# Altium project Qadrature FM demodulator.PrjPcb
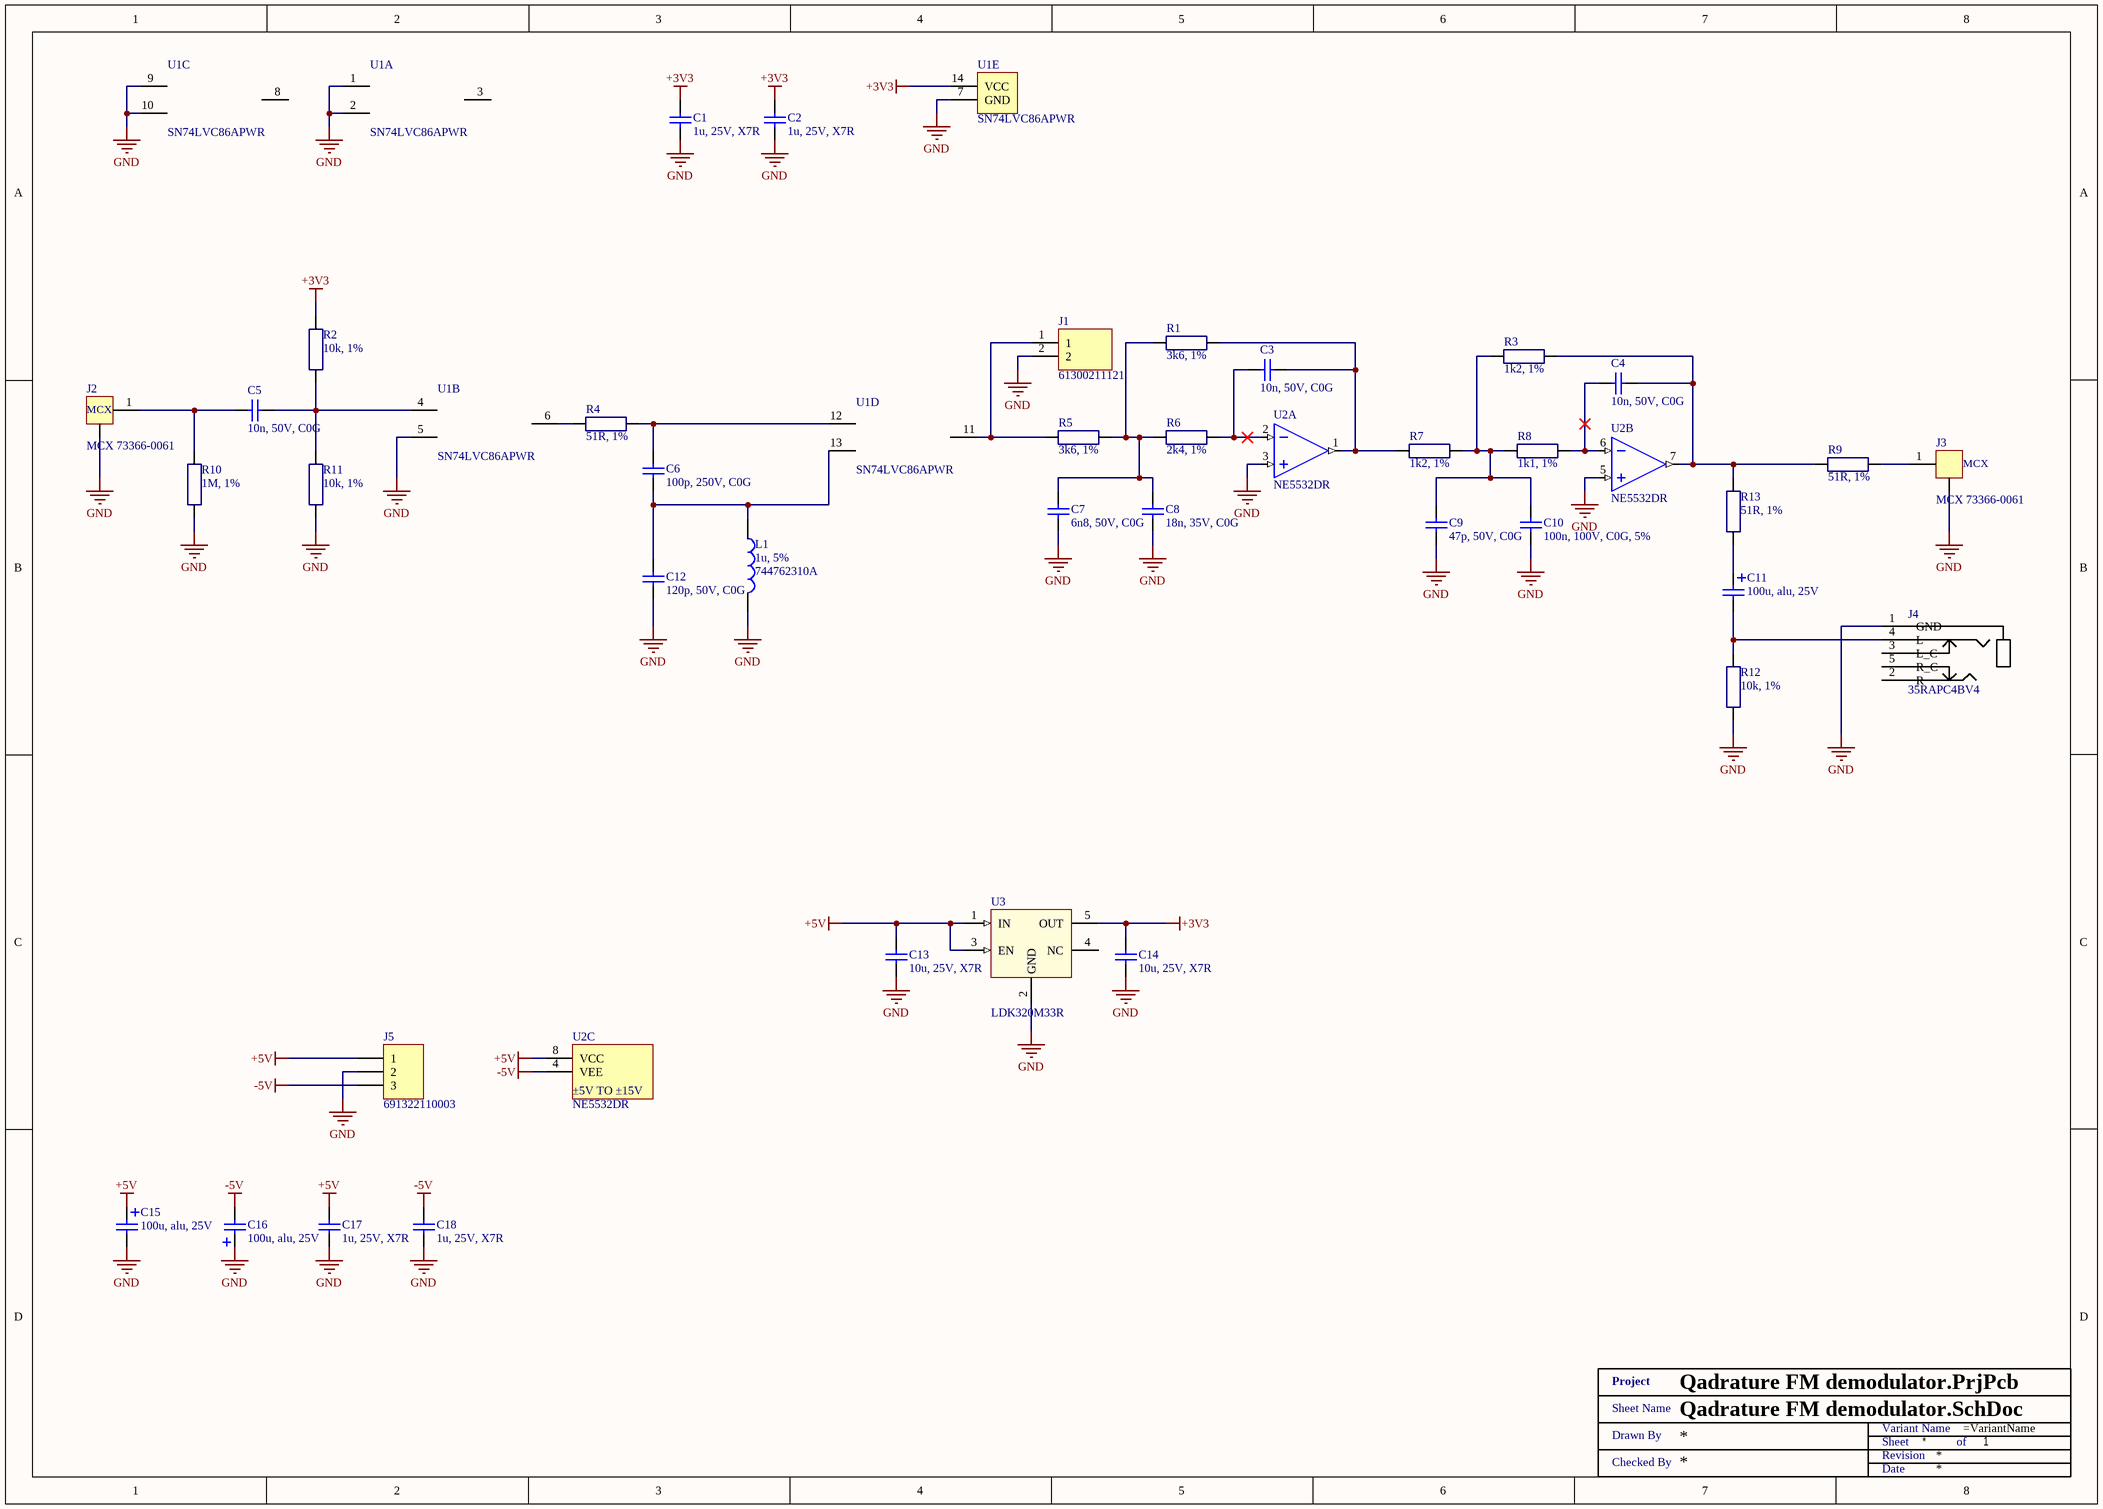
[diagram p0: Qadrature FM demodulator.SchDoc]
1 sheet, 41 parts. Net scope: global (net labels, ports and power ports of the same name join across sheets).
Board file: Qadrature FM demodulator.PcbDoc

## Sheet Qadrature FM demodulator.SchDoc
size A3; SheetNumber: 1; SheetTotal: 1

### Parts
C1  1u, 25V, X7R  [SMD0603]
C2  1u, 25V, X7R  [SMD0603]
C3  10n, 50V, C0G  [SMD0603]
C4  10n, 50V, C0G  [SMD0603]
C5  10n, 50V, C0G  [SMD0603]
C6  100p, 250V, C0G  [SMD0603]
C7  6n8, 50V, C0G  [SMD0603]
C8  18n, 35V, C0G  [SMD0603]
C9  47p, 50V, C0G  [SMD0805]
C10  100n, 100V, C0G, 5%  [SMD1206]
C11  100u, alu, 25V  [WCAP-ATLI_6.3x11x2.5]
C12  120p, 50V, C0G  [SMD0603]
C13  10u, 25V, X7R  [SMD1206]
C14  10u, 25V, X7R  [SMD1206]
C15  100u, alu, 25V  [WCAP-ATLI_6.3x11x2.5]
C16  100u, alu, 25V  [WCAP-ATLI_6.3x11x2.5]
C17  1u, 25V, X7R  [SMD0603]
C18  1u, 25V, X7R  [SMD0603]
J1  61300211121  [Header 2 2.54mm]
J2  MCX 73366-0061  [73366-0061]
J3  MCX 73366-0061  [73366-0061]
J4  35RAPC4BV4  [35RAPC4BV4]
J5  691322110003  [691322110003]
L1  1u, 5%  [WE-KI_1008]
R1  3k6, 1%  [SMD0603 - R]
R2  10k, 1%  [SMD0603 - R]
R3  1k2, 1%  [SMD0603 - R]
R4  51R, 1%  [SMD0603 - R]
R5  3k6, 1%  [SMD0603 - R]
R6  2k4, 1%  [SMD0603 - R]
R7  1k2, 1%  [SMD0603 - R]
R8  1k1, 1%  [SMD0603 - R]
R9  51R, 1%  [SMD0603 - R]
R10  1M, 1%  [SMD0603 - R]
R11  10k, 1%  [SMD0603 - R]
R12  10k, 1%  [SMD0603 - R]
R13  51R, 1%  [SMD0603 - R]
U1  SN74LVC86APWR  [TSSOP14]  (parts A,B,C,D,E of 5)
U2  NE5532DR  [SOIC08]  (parts A,B,C of 3)
U3  LDK320M33R  [SOT23-5]
XX?  Title 1  (value not drawn)  (graphical)

### Nets
+3V3: C1.2 C2.2 C14.2 R2.2 U1.14(VCC) U3.5(OUT)
+5V: C13.2 C15.1 C17.2 J5.1 U2.8(VCC) U3.1(IN) U3.3(EN)
-5V: C16.2 C18.2 J5.3 U2.4(VEE)
GND: C1.1 C2.1 C7.1 C8.1 C9.1 C10.1 C12.1 C13.1 C14.1 C15.2 C16.1 C17.1 C18.1 J1.2 J2.2(GND) J3.2(GND) J4.1(GND) J5.2 L1.2 R10.1 R11.1 R12.1 U1.1(1A) U1.2(1B) U1.5(2B) U1.7(GND) U1.9(3A) U1.10(3B) U2.3(+IN_A) U2.5(+IN_B) U3.2(GND)
NetC3_1: C3.1 R6.2 U2.2(-IN_A)
NetC3_2: C3.2 R1.2 R7.1 U2.1(OUT_A)
NetC4_1: C4.1 R8.2 U2.6(-IN_B)
NetC4_2: C4.2 R3.2 R9.1 R13.2 U2.7(OUT_B)
NetC5_1: C5.1 J2.1(INPUT) R10.2
NetC5_2: C5.2 R2.1 R11.2 U1.4(2A)
NetC6_1: C6.1 C12.2 L1.1 U1.13(4B)
NetC6_2: C6.2 R4.2 U1.12(4A)
NetC7_2: C7.2 C8.2 R1.1 R5.2 R6.1
NetC9_2: C9.2 C10.2 R3.1 R7.2 R8.1
NetC11_1: C11.1 R13.1
NetC11_2: C11.2 J4.4(L) R12.2
NetJ1_1: J1.1 R5.1 U1.11(4Y)
NetJ3_1: J3.1(INPUT) R9.2
NetR4_1: R4.1 U1.6(2Y)

Not connected (* = marked no-connect by the designer): J4 2(R) 3(L_C) 5(R_C); U1 3(1Y) 8(3Y); U3 4(NC)

### Notes on the sheet
- (in symbol NE5532DR, part C) ±5V TO ±15V
- (in symbol Title 1) Project; Sheet Name; Variant Name; Drawn By; Sheet; of; Revision; Checked By; Date

### Library data of the parts
C1 C2 C17 C18 = CGA3E1X7R1E105K080AC: CAP CER 1UF 25V X7R 0603; Manufacturer: TDK Corporation; Tolerance: ±10%; Manufacturer Part Number: CGA3E1X7R1E105K080AC; RoHS: RoHS Compliant; Category: Capacitors; Stock 1: 109509; Pricing 1: 1=0.2, 10=0.135, 100=0.0686, 500=0.04696, 1000=0.04154 (USD); Packaging: Cut Tape (CT); Part Status: Active; Voltage - Rated: 25V; Temperature Coefficient: X7R; Operating Temperature: -55°C ~ 125°C; Features: -; Ratings: AEC-Q200; Applications: Automotive; Failure Rate: -; Mounting Type: Surface Mount, MLCC; Package / Case: 0603 (1608 Metric); Size / Dimension: 0.063" L x 0.032" W (1.60mm x 0.80mm); Height - Seated (Max): -; Thickness (Max): 0.035" (0.90mm); Lead Spacing: -; Lead Style: -; ComponentLink1URL: https://product.tdk.com/info/en/catalog/datasheets/mlcc_automotive_general_en.pdf; ComponentLink1Description: https://product.tdk.com/info/en/catalog/datasheets/mlcc_automotive_general_en.pdf; Capacitance: 1u; Supplier 1: Mouser; Supplier Part Number 1: 810-CGA3E1X7R1E105K; Supplier 2: Farnell; Supplier Part Number 2: 2346962; Supplier 3: Digi-Key; Supplier Part Number 3: 445-6931-1-ND
C3-C5 = GRM1885C1H103JA01D: Multilayer Ceramic Capacitors MLCC - SMD/SMT 0603 50VDC 10000pF 5% C0G; Manufacturer: Murata Electronics; Type: Chip Multilayer Ceramic Capacitor for General Purpose; Capacitance - nF: 10 nF; Class: Class 1; CNHTS: 8532241000; Dielectric: C0G (NP0); TARIC: 8532240000; Supplier 1: Mouser; Supplier Part Number 1: 81-GRM1885C1H103JA1D; Manufacturer Part Number: GRM1885C1H103JA01D; RoHS: RoHS Compliant; Category: Multilayer Ceramic Capacitors MLCC - SMD/SMT; Stock 1: 217291; Pricing 1: 1=0.183, 10=0.129, 100=0.065, 500=0.045, 1000=0.039, 4000=0.030, 8000=0.027, 24000=0.025 (EUR); Capacitance: 10n; Height: 0.8 mm; Length: 1.6 mm; Package / Case: 0603 (1608 metric); Packaging: Cut Tape; Product: General Type MLCCs; Series: GRM; Termination Style: SMD/SMT; Tolerance: 5 %; Voltage Rating DC: 50 VDC; Width: 0.8 mm; Brand: Murata Electronics; Capacitance - pF: 10000 pF; Case Code - in: 0603; Case Code - mm: 1608; HTS Code: 8532240020; Maximum Operating Temperature: + 125 C; Minimum Operating Temperature: - 55 C; Product Type: Ceramic Capacitors; Standard Pack Qty: 4000; Subcategory: Capacitors; Termination: Standard; RoHS - Mouser: Y; Minimum Order Quantity: 1; Reeling: True; ComponentLink1URL: http://www.mouser.com/datasheet/2/281/murata_03052018_GRM_Series_1-1310166.pdf; ComponentLink1Description: http://www.mouser.com/datasheet/2/281/murata_03052018_GRM_Series_1-1310166.pdf; Supplier 2: Farnell; Supplier Part Number 2: 2456107
C6 = 885342006003: CAP CER 100PF 250V C0G/NP0 0603; Manufacturer: Wurth Electronics Inc.; Tolerance: ±5%; Temperature Coefficient: C0G, NP0; Notification: Current market demand for these product types have resulted in fluctuating and extending lead times. Lead times may differ.; Supplier 1: Digi-Key; Supplier Part Number 1: 732-12167-1-ND; Manufacturer Part Number: 885342006003; RoHS: RoHS Compliant; Category: Capacitors; Stock 1: 43; Pricing 1: 1=0.1, 10=0.043, 100=0.0385, 500=0.03406 (USD); Packaging: Cut Tape (CT); Part Status: Active; Voltage - Rated: 250V; Operating Temperature: -55°C ~ 125°C; Features: -; Ratings: -; Applications: General Purpose; Failure Rate: -; Mounting Type: Surface Mount, MLCC; Package / Case: 0603 (1608 Metric); Size / Dimension: 0.063" L x 0.031" W (1.60mm x 0.80mm); Height - Seated (Max): -; Thickness (Max): 0.034" (0.87mm); Lead Spacing: -; Lead Style: -; ComponentLink1URL: https://katalog.we-online.de/pbs/datasheet/885342006003.pdf; ComponentLink1Description: https://katalog.we-online.de/pbs/datasheet/885342006003.pdf; Supplier 2: Farnell; Supplier Part Number 2: 2812519; Supplier 3: Mouser; Supplier Part Number 3: 710-885342006003; Capacitance: 100p
C7 = GRM1885C1H682JA01D: Multilayer Ceramic Capacitors MLCC - SMD/SMT 0603 6,800pF 50volts C0G +/-5%; Manufacturer: Murata; Tolerance: 5%; Supplier 1: Mouser; Supplier Part Number 1: 81-GRM1885C1H682JA1D; Manufacturer Part Number: GRM1885C1H682JA01D; Stock 1: 117152; Pricing 1: 1 = 0.20000, 10 = 0.13500, 50 = 0.13500, 100 = 0.06800, 1000 = 0.04100, 10000 = 0.02900 (USD); RoHS: Yes; Mount: Surface Mount; Case/Package: 0603; Case Code (Metric): 1608; Case Code (Imperial): 0603; Min Operating Temperature: -55°C; Max Operating Temperature: 125°C; Packaging: Tape and Reel; Capacitance: 6n8; Voltage Rating: 50V; Voltage Rating (DC): 50V; Package Quantity: 4000; Dielectric: C0G; Termination: SMD/SMT; Length: 1.6mm; Height: 0.8mm; Width: 0.031inch; Thickness: 0.035inch; Depth: 0.8mm; Lead Free: Lead Free; ComponentLink1URL: https://datasheet.ciiva.com/29537/partnumbering-e-01-29537912.pdf?src-supplier=Digi-Key; ComponentLink1Description: https://datasheet.ciiva.com/29537/partnumbering-e-01-29537912.pdf?src-supplier=Digi-Key; Supplier 2: Digi-Key; Supplier Part Number 2: 490-11477-1-ND; Supplier 3: Arrow; Supplier Part Number 3: GRM1885C1H682JA01D
C8 = C1608C0G1V183J080AC: Cap Ceramic 0.018uF 35V C0G 5% Pad SMD 0603 125C T/R; Manufacturer: TDK; Supplier 1: Mouser; Supplier Part Number 1: 810-C1608C0G1V183JAC; Manufacturer Part Number: C1608C0G1V183J080AC; RoHS: Yes; Category: Ceramic Capacitors; Stock 1: 3185; Pricing 1: 1=0.37000, 10=0.16800, 50=0.16800, 100=0.14300, 1000=0.08800, 10000=0.06600 (USD); Mount: Surface Mount; Case/Package: 0603; Case Code (Metric): 1608; Case Code (Imperial): 0603; Dielectric Material: Ceramic; Min Operating Temperature: -55°C; Max Operating Temperature: 125°C; Packaging: Tape and Reel; Capacitance: 18n; Voltage Rating: 35V; Tolerance: 5%; Voltage Rating (DC): 35V; Length: 0.063inch; Width: 0.031inch; Thickness: 0.035inch; Lead Free: Lead Free; RoHS Compliant: Yes; ComponentLink1URL: https://product.tdk.com/info/en/catalog/spec/mlccspec_commercial_general_midvoltage_en.pdf?src-supplier=Digi-Key; ComponentLink1Description: https://product.tdk.com/info/en/catalog/spec/mlccspec_commercial_general_midvoltage_en.pdf?src-supplier=Digi-Key; Supplier 2: Farnell; Supplier Part Number 2: 3416084; Supplier 3: Digi-Key; Supplier Part Number 3: 445-174558-1-ND; Supplier 4: Newark; Supplier Part Number 4: 71AH3230
C9 = MC0805N470J500CT: MULTICOMP - MC0805N470J500CT - CAP, MLCC, C0G/NP0, 47PF, 50V, 0805; Ceramic Capacitor Case: 0805 [2012 Metric]; Capacitance: 47; Voltage Rating: 50; Capacitance Tolerance: ± 5%; Product Range: MC Series; SVHC: No SVHC (07-Jul-2017)<!--FANDB--><div class="features-and-benefits-container"><div class="features-and-benefits-desc-container"><span class="features-and-benefits-container-desc">SMD Multilayer Ceramic Capacitor, 0805 [2012 Metric], 47 pF, 50 V, ± 5%, C0G / NP0, MC Series</span></div><div class="features-and-benefits-description"><span class="features-benefits-value">The Multicomp MC series is general purpose MLCC capacitors with C0G (NP0) dielectric material which provides high electrical precision, stability and reliability. This MLCC capacitor consists of a conducting material and electrodes with high density and high efficiency ceramic condensers.</span></div><div class="features-and-benefits-list"><ul class="features-and-benefits-list-list"><li class="features-and-benefits-list-item">Small size with higher capacitance values</li><li class="features-and-benefits-list-item">0201, 0402, 0603, 0805, 1206, 1210, 1812 case sizes available</li><li class="features-and-benefits-list-item">Capacitance value ranging from 0.1pF to 0.1?F</li><li class="features-and-benefits-list-item">Capacitor with lead free termination (pure Tin)</li><li class="features-and-benefits-list-item">High electrical precision, stability and reliability</li><li class="features-and-benefits-list-item">Rated voltage of 10V, 16V, 25V, 50V, 100V</li><li class="features-and-benefits-list-item">Operating temperature of -55°C to +125°C</li><li class="features-and-benefits-list-item">Temperature coefficient (TCR) of ±30; Supplier 1: Farnell; Supplier Part Number 1: 1759199; Manufacturer: MULTICOMP; Manufacturer Part Number: MC0805N470J500CT; RoHS: YES; Stock 1: 26554; Pricing 1: 10=0.0144, 100=0.0117, 500=0.0083, 1000=0.0072, 2000=0.0057 (GBP); Dielectric Characteristic: C0G / NP0; Packaging: Cut Tape; Operating Temperature Min: -55; Operating Temperature Max: 125; Automotive Qualification Standard: -; MSL: -; ComponentLink1URL: http://www.farnell.com/datasheets/1901289.pdf; ComponentLink1Description: http://www.farnell.com/datasheets/1901289.pdf
C10 = GRM31C5C2A104JA01L: CAP CER 0.1UF 100V C0G/NP0 1206; Manufacturer: Murata Electronics North America; Temperature Coefficient: C0G, NP0; Notification: Current market demand for these product types have resulted in fluctuating and extending lead times. Lead times may differ.; Manufacturer Part Number: GRM31C5C2A104JA01L; RoHS: RoHS Compliant; Category: Capacitors; Stock 1: 1640; Pricing 1: 1=0.82, 10=0.581, 100=0.3823, 500=0.2832, 1000=0.24072 (USD); Packaging: Cut Tape (CT); Part Status: Active; Tolerance: ±5%; Voltage - Rated: 100V; Operating Temperature: -55°C ~ 125°C; Features: -; Ratings: -; Applications: General Purpose; Failure Rate: -; Mounting Type: Surface Mount, MLCC; Package / Case: 1206 (3216 Metric); Size / Dimension: 0.126" L x 0.063" W (3.20mm x 1.60mm); Height - Seated (Max): -; Thickness (Max): 0.071" (1.80mm); Lead Spacing: -; Lead Style: -; ComponentLink1URL: http://search.murata.co.jp/Ceramy/image/img/A01X/G101/ENG/GRM31C5C2A104JA01-01.pdf; ComponentLink1Description: http://search.murata.co.jp/Ceramy/image/img/A01X/G101/ENG/GRM31C5C2A104JA01-01.pdf; Capacitance: 100n; Dielectric: C0G; Supplier 1: Mouser; Supplier Part Number 1: 81-GRM31C5C2A104JA1L; Supplier 2: Digi-Key; Supplier Part Number 2: 490-16315-1-ND
C11 C15 C16 = 860010473007: CAP 100 UF 20% 25 V; Manufacturer: Wurth Electronics; Material: Aluminium; Capacitance: 100uF; Polarity: Polar; Ripple Current: 209mA; Life (Hours): 2000Hour; Supplier 1: Mouser; Supplier Part Number 1: 710-860010473007; Manufacturer Part Number: 860010473007; RoHS: Yes; Category: Aluminum Electrolytic Capacitors; Stock 1: 1494; Pricing 1: 1=0.14000, 10=0.13400, 25=0.13400, 50=0.11200, 100=0.09800, 250=0.08700 (USD); Mount: Through Hole; Case/Package: Radial; Min Operating Temperature: -40°C; Max Operating Temperature: 85°C; Tolerance: 20%; Voltage Rating (DC): 25V; Package Quantity: 1500; Packaging: Tape and Reel; Voltage Rating: 25V; Diameter: 6.3mm; Height: 11mm; Lead Pitch: 0.098inch; Height - Seated (Max): 0.492inch; REACH SVHC: Unknown; ComponentLink1URL: https://datasheet.ciiva.com/48693/001280151-da-01-en-wcap-atg8-alu-elec-caps-860010473007-48693591.pdf?src-supplier=Conrad; ComponentLink1Description: https://datasheet.ciiva.com/48693/001280151-da-01-en-wcap-atg8-alu-elec-caps-860010473007-48693591.pdf?src-supplier=Conrad; Supplier 2: Farnell; Supplier Part Number 2: 2465675; Supplier 3: Digi-Key; Supplier Part Number 3: 732-8630-1-ND
C12 = CC0603JRNPO9BN121: Surface Mount Ceramic Multilayer Capacitor 120pF 5% C0G 50V 0603 Paper T/R; Manufacturer: Yageo; Insulation Resistance: 100GR; Supplier 1: Mouser; Supplier Part Number 1: 603-CC603JRNPO9BN121; Manufacturer Part Number: CC0603JRNPO9BN121; RoHS: Yes; Category: Ceramic Capacitors; Stock 1: 20714; Pricing 1: 1=0.10000, 10=0.06400, 50=0.06400, 100=0.02900, 1000=0.01700, 10000=0.01100 (USD); Mount: Surface Mount; Case/Package: 0603; Case Code (Metric): 1608; Case Code (Imperial): 0603; Dielectric Material: Ceramic; Min Operating Temperature: -55°C; Max Operating Temperature: 125°C; Capacitance: 120pF; Tolerance: 5%; Packaging: Tape and Reel; Voltage Rating: 50V; Voltage Rating (DC): 50V; Package Quantity: 1; Dielectric: C0G; Termination: SMD/SMT; Resistor Type: Ceramic; Series: CC; Length: 1.6mm; Width: 0.031inch; Height: 0.8mm; Thickness: 0.035inch; Depth: 0.8mm; Radiation Hardening: No; REACH SVHC: Unknown; Lead Free: Lead Free; RoHS Compliant: Yes; ComponentLink1URL: https://datasheet.ciiva.com/26862/getdatasheetpartid-137962-26862760.pdf?src-supplier=Verical; ComponentLink1Description: https://datasheet.ciiva.com/26862/getdatasheetpartid-137962-26862760.pdf?src-supplier=Verical; ComponentLink2URL: https://datasheet.ciiva.com/144/mlccorderingcode-144699.pdf?src-supplier=Digi-Key; ComponentLink2Description: https://datasheet.ciiva.com/144/mlccorderingcode-144699.pdf?src-supplier=Digi-Key; ComponentLink3URL: https://datasheet.ciiva.com/8033/1443161-8033719.pdf?src-supplier=Element14; ComponentLink3Description: https://datasheet.ciiva.com/8033/1443161-8033719.pdf?src-supplier=Element14; ComponentLink4URL: https://datasheet.ciiva.com/17437/upy-gp-np0-16v-to-50v-8-17437015.pdf?src-supplier=Avnet+Europe; ComponentLink4Description: https://datasheet.ciiva.com/17437/upy-gp-np0-16v-to-50v-8-17437015.pdf?src-supplier=Avnet+Europe; ComponentLink5URL: https://datasheet.ciiva.com/8033/1443161-8033720.pdf?src-supplier=Element14; ComponentLink5Description: https://datasheet.ciiva.com/8033/1443161-8033720.pdf?src-supplier=Element14; ComponentLink6URL: https://datasheet.ciiva.com/144/mlccorderingcode-144697.pdf?src-supplier=Digi-Key; ComponentLink6Description: https://datasheet.ciiva.com/144/mlccorderingcode-144697.pdf?src-supplier=Digi-Key; ComponentLink7URL: https://datasheet.ciiva.com/11465/upy-gp-np0-16v-to-50v-8-11465007.pdf?src-supplier=Avnet; ComponentLink7Description: https://datasheet.ciiva.com/11465/upy-gp-np0-16v-to-50v-8-11465007.pdf?src-supplier=Avnet; ComponentLink8URL: https://datasheet.ciiva.com/144/mlccorderingcode-144698.pdf?src-supplier=Digi-Key; ComponentLink8Description: https://datasheet.ciiva.com/144/mlccorderingcode-144698.pdf?src-supplier=Digi-Key; ComponentLink9URL: https://datasheet.ciiva.com/15381/upy-gp-np0-16v-to-50v-8-15381898.pdf?src-supplier=Mouser; ComponentLink9Description: https://datasheet.ciiva.com/15381/upy-gp-np0-16v-to-50v-8-15381898.pdf?src-supplier=Mouser; Supplier 2: Farnell; Supplier Part Number 2: 722091; Supplier 3: Digi-Key; Supplier Part Number 3: 311-1070-1-ND
C13 C14 = GRM31CR71E106KA12L: MURATA - GRM31CR71E106KA12L - CAP, MLCC, X7R, 10UF, 25V, 1206; Manufacturer: MURATA; Manufacturer Part Number: GRM31CR71E106KA12L; RoHS: YES; Stock 1: 8848; Pricing 1: 5=0.278, 50=0.185, 250=0.139, 500=0.134, 1000=0.128 (GBP); ComponentLink1URL: http://www.farnell.com/datasheets/2048746.pdf; ComponentLink1Description: http://www.farnell.com/datasheets/2048746.pdf; Capacitance: 10u; Dielectric: X7R; Supplier 1: Mouser; Supplier Part Number 1: 81-GRM31CR71E106KA12; Supplier 2: Farnell; Supplier Part Number 2: 1828837; Supplier 3: Digi-Key; Supplier Part Number 3: 490-6518-1-ND
J1 = 61300211121: CONN HEADER 2 POS 2.54; Manufacturer: Wurth Electronics Inc.; Pitch - Mating: 0.100" (2.54mm); Number of Positions: 2; Number of Positions Loaded: All; Style: Board to Board or Cable; Shrouding: Unshrouded; Contact Length - Mating: 0.236" (6.00mm); Contact Length - Post: 0.118" (3.00mm); Overall Contact Length: 0.454" (11.54mm); Material Flammability Rating: UL94 V-0; Current Rating: 3A; Voltage Rating: 250V; Manufacturer Part Number: 61300211121; RoHS: RoHS Compliant; Category: Connectors, Interconnects; Stock 1: 164911; Pricing 1: 1=0.13, 10=0.106, 25=0.088, 50=0.074, 100=0.067, 1000=0.061 (USD); Packaging: Bulk; Part Status: Active; Connector Type: Header; Contact Type: Male Pin; Number of Rows: 1; Row Spacing - Mating: -; Mounting Type: Through Hole; Termination: Solder; Fastening Type: Push-Pull; Insulation Height: 0.100" (2.54mm); Contact Shape: Square; Contact Finish - Mating: Gold; Contact Finish Thickness - Mating: -; Contact Finish - Post: -; Contact Material: Copper Alloy; Insulation Material: Polybutylene Terephthalate (PBT); Features: -; Operating Temperature: -40°C ~ 125°C; Ingress Protection: -; Insulation Color: Black; Mated Stacking Heights: -; Contact Finish Thickness - Post: -; Applications: -; ComponentLink1URL: https://katalog.we-online.de/em/datasheet/6130xx11121.pdf; ComponentLink1Description: https://katalog.we-online.de/em/datasheet/6130xx11121.pdf; Supplier 1: Mouser; Supplier Part Number 1: 710-61300211121; Supplier 2: Farnell; Supplier Part Number 2: 2356153; Supplier 3: Digi-Key; Supplier Part Number 3: 732-5315-ND
J2 J3 = 73366-0061: CONN MCX JACK STR 50 OHM PCB; Manufacturer: Molex, LLC; Manufacturer Part Number: 0733660061; Connector Type: Jack, Female Socket; Contact Termination: Solder; Impedance: 50 Ohm; Body Material: Brass; Body Finish: Gold; Dielectric Material: Polytetrafluoroethylene (PTFE); Center Contact Material: Beryllium Copper; Mating Cycles: 500; RoHS: RoHS Compliant; Category: Connectors, Interconnects; Stock 1: 39394; Pricing 1: 1=1.95, 10=1.765, 25=1.6572, 50=1.5854, 100=1.5133, 250=1.36916, 500=1.26106, 1000=1.0809, 2500=1.00884 (USD); Packaging: Tray; Part Status: Active; Connector Style: MCX; Shield Termination: Solder; Mounting Type: Through Hole; Mounting Feature: -; Cable Group: -; Fastening Type: Snap-On; Features: -; Housing Color: Gold; Ingress Protection: -; Includes: -; Center Contact Plating: Gold; Operating Temperature: -55°C ~ 155°C; Insertion Loss: -; ComponentLink1URL: https://www.molex.com/pdm_docs/sd/733660061_sd.pdf; ComponentLink1Description: https://www.molex.com/pdm_docs/sd/733660061_sd.pdf; Supplier 1: Mouser; Supplier Part Number 1: 538-73366-0061; Supplier 2: Digi-Key; Supplier Part Number 2: WM5541-ND; Supplier 3: Farnell; Supplier Part Number 3: 1909245
J4 = 35RAPC4BV4: SWITCHCRAFT - 35RAPC4BV4 - CONNECTOR, RCA/PHONO, JACK, 3WAY; No. of Contacts: 3; Pin Diameter: 3.5; Connector Mounting: PCB Mount; Connector Body Material: Plastic Body; SVHC: No SVHC (15-Jun-2015); Connector Colour: Black; Contact Termination: Solder<!--FANDB--><div class="features-and-benefits-container"><div class="features-and-benefits-description"><span class="features-benefits-value">The 35RAPC4BV4 is a 3.5mm Mono and Stereo PC Board Vertical-mount Jack with black PBT+15% glass filled housing, nickel-plated brass bushing, tin-plated phosphor bronze springs and a clear polycarbonate cover. The compact design and an easy of installation onto a PCB make this an ideal solution.</span></div><div class="features-and-benefits-list"><ul class="features-and-benefits-list-list"><li class="features-and-benefits-list-item">5000 cycles Life</li><li class="features-and-benefits-list-item">50; Supplier 1: Farnell; Supplier Part Number 1: 2293877; Manufacturer: SWITCHCRAFT; Manufacturer Part Number: 35RAPC4BV4; RoHS: YES; Stock 1: 216; Pricing 1: 1=1.28, 25=1.11, 50=1.06, 100=1.01, 250=0.975, 500=0.939 (GBP); Gender: Jack; Contact Plating: Tin Plated Contacts; Product Range: -; ComponentLink1URL: http://www.farnell.com/datasheets/921436.pdf; ComponentLink1Description: http://www.farnell.com/datasheets/921436.pdf; Supplier 2: Digi-Key; Supplier Part Number 2: SC1461-ND
J5 = 691322110003: WR-TBL Serie 3221 - 3.50 mm Horizontal PCB Header, 03p; Pitch: 3.5 mm; Published Date: Jan 2017; Publisher: Wurth Elektronik; ComponentLink1Description: Manufacturer; ComponentLink1URL: http://www.we-online.de; ComponentLink2Description: Datasheet; ComponentLink2URL: http://katalog.we-online.de/em/datasheet/6913221100xx.pdf; Part Number: 691322110003; Pin Number: 03p; Supplier 1: Digi-Key; Supplier Part Number 1: 732-2770-ND; Supplier 2: Farnell; Supplier Part Number 2: 1841316
L1 = 744762310A: Fixed Ind 1UH 120MA 3.3 Ohm SMD; Manufacturer: Wurth Electronics; Core Material: Ceramic; Shielding: Unshielded; Self Resonant Frequency: 310MHz; DC Resistance (DCR): 3.3R; Test Frequency: 25MHz; Q Factor: 35; Supplier 1: Mouser; Supplier Part Number 1: 710-744762310A; RoHS: Yes; Category: Fixed Inductors; Stock 1: 1904; Pricing 1: 1=0.41000, 10=0.38200, 50=0.35700, 100=0.33000, 1000=0.30300, 10000=0.25600 (USD); Mount: Surface Mount; Case/Package: 1008; Case Code (Metric): 2520; Case Code (Imperial): 1008; Min Operating Temperature: -40°C; Max Operating Temperature: 125°C; Package Quantity: 2000; Current Rating: 120mA; Tolerance: 5%; Packaging: Tape and Reel; Resistor Type: Wirewound,Ceramic; Inductance: 1uH; Max DC Current: 120mA; Termination: SMD/SMT; Series: WE-KI; Length: 0.102inch; Width: 0.083inch; Height: 0.039inch; Height - Seated (Max): 0.075inch; RoHS Compliant: Yes; ComponentLink1URL: https://datasheet.ciiva.com/1049/744762310a-1049271.pdf?src-supplier=Digi-Key; ComponentLink1Description: https://datasheet.ciiva.com/1049/744762310a-1049271.pdf?src-supplier=Digi-Key; ComponentLink2URL: https://datasheet.ciiva.com/4978/744762310a-69476-4978731.pdf?src-supplier=Mouser; ComponentLink2Description: https://datasheet.ciiva.com/4978/744762310a-69476-4978731.pdf?src-supplier=Mouser; ComponentLink3URL: https://datasheet.ciiva.com/1049/744762310a-1049272.pdf?src-supplier=Digi-Key; ComponentLink3Description: https://datasheet.ciiva.com/1049/744762310a-1049272.pdf?src-supplier=Digi-Key; ComponentLink4URL: https://datasheet.ciiva.com/1049/744762310a-1049273.pdf?src-supplier=Digi-Key; ComponentLink4Description: https://datasheet.ciiva.com/1049/744762310a-1049273.pdf?src-supplier=Digi-Key; Supplier 2: Farnell; Supplier Part Number 2: 3517053; Supplier 3: Digi-Key; Supplier Part Number 3: 732-1832-1-ND; Manufacturer Part Number: 744762310A
R1 R5 = RC0603FR-073K6L: RES SMD 3.6K OHM 1% 1/10W 0603; Manufacturer: Yageo; Power Rating: 100mW; Voltage Rating: 50V; Temperature Coefficient: 100ppm/°C; Working Voltage: 75V; Supplier 1: Mouser; Supplier Part Number 1: 603-RC0603FR-073K6L; Manufacturer Part Number: RC0603FR-073K6L; RoHS: Yes; Category: Chip SMD Resistors; Stock 1: 130231; Pricing 1: 1=0,10000, 10=0,01800, 50=0,01800, 100=0,00600, 1000=0,00500, 10000=0,00300 (USD); Case/Package: 0603; Number of Pins: 2; Case Code (Imperial): 0603; Case Code (Metric): 1608; Min Operating Temperature: -55°C; Max Operating Temperature: 155°C; Resistance: 3k6; Tolerance: 1%; Package Quantity: 1; Packaging: Tape and Reel; Termination: SMD/SMT; Resistor Type: Thick Film; Number of Terminations: 2; Max Power Dissipation: 100mW; Voltage Rating (DC): 50V; Features: Moisture Resistant; Series: RC; Technology: METAL OXIDE FILM; Resistance Tolerance: 1%; Length: 0.063inch; Width: 0.8mm; Height: 0.022inch; REACH SVHC: Unknown; Lead Free: Lead Free; RoHS Compliant: Yes; ComponentLink1URL: https://datasheet.ciiva.com/2455/pyu-r-int-thick-7-2455116.pdf?src-supplier=Digi-Key; ComponentLink1Description: https://datasheet.ciiva.com/2455/pyu-r-int-thick-7-2455116.pdf?src-supplier=Digi-Key; ComponentLink2URL: https://datasheet.ciiva.com/2455/pyu-r-int-thick-7-2455117.pdf?src-supplier=Digi-Key; ComponentLink2Description: https://datasheet.ciiva.com/2455/pyu-r-int-thick-7-2455117.pdf?src-supplier=Digi-Key; ComponentLink3URL: https://datasheet.ciiva.com/2455/pyu-r-int-thick-7-2455118.pdf?src-supplier=Digi-Key; ComponentLink3Description: https://datasheet.ciiva.com/2455/pyu-r-int-thick-7-2455118.pdf?src-supplier=Digi-Key; Supplier 2: Farnell; Supplier Part Number 2: 3495832; Supplier 3: Digi-Key; Supplier Part Number 3: 311-3.60KHRCT-ND
R2 R11 R12 = RC0603FR-0710KL: YAGEO (PHYCOMP) - RC0603FR-0710KL - RES, THICK FILM, 10K, 1%, 0.1W, 0603; Voltage Rating: 50; Resistor Case Style: 0603 [1608 Metric]; Power Rating: 100; Product Range: RC Series; Temperature Coefficient: ± 100; SVHC: No SVHC (20-Jun-2016); Manufacturer: YAGEO (PHYCOMP); Manufacturer Part Number: RC0603FR-0710KL; RoHS: YES; Stock 1: 9995; Pricing 1: 5000=0.0025, 25000=0.0014, 50000=0.0013 (GBP); Resistance: 10k; Resistance Tolerance: ± 1%; Packaging: Tape & Reel; Resistor Element Material: Thick Film; Automotive Qualification Standard: -; MSL: MSL 1 - Unlimited<!--FANDB--><div class="features-and-benefits-container"><div class="features-and-benefits-desc-container"><span class="features-and-benefits-container-desc">SMD Chip Resistor, Thick Film, 10 kohm, 50 V, 0603 [1608 Metric], 100 mW, ± 1; ComponentLink1URL: http://past.yageo.com/pdf/PYu-R_Packing_6.pdf; ComponentLink1Description: http://past.yageo.com/pdf/PYu-R_Packing_6.pdf; ComponentLink2URL: http://www.farnell.com/datasheets/2167052.pdf; ComponentLink2Description: http://www.farnell.com/datasheets/2167052.pdf; Supplier 1: Mouser; Supplier Part Number 1: 603-RC0603FR-0710KL; Supplier 2: Farnell; Supplier Part Number 2: 2421850; Supplier 3: Digi-Key; Supplier Part Number 3: 311-10.0KHRCT-ND
R3 R7 = WR06X1201FTL: WALSIN - WR06X1201FTL - RESISTOR, THICK FILM, 1K2, 1%, 75V, 0603; Voltage Rating: 75; Resistor Case Style: 0603 [1608 Metric]; Power Rating: 100; Product Range: WR06 Series; Temperature Coefficient: ± 100; Manufacturer: WALSIN; Manufacturer Part Number: WR06X1201FTL; RoHS: YES; Stock 1: 8072; Pricing 1: 10=0.0134, 100=0.0045, 500=0.0027, 1000=0.0019, 2500=0.0015 (GBP); Resistance: 1k2; Resistance Tolerance: ± 1%; Packaging: Cut Tape; Resistor Element Material: Thick Film; Automotive Qualification Standard: -; MSL: MSL 2 - 1 year<!--FANDB--><div class="features-and-benefits-container"><div class="features-and-benefits-desc-container"><span class="features-and-benefits-container-desc">SMD Chip Resistor, 1.2 kohm, 75 V, 0603 [1608 Metric], 100 mW, ± 1%, WR06 Series</span></div><div class="features-and-benefits-description"><span class="features-benefits-value">The WR06 series resistors from Walsin are general purpose thick film chip resistors. These resistors are constructed in a high grade ceramic body (aluminium oxide).</span></div><div class="features-and-benefits-list"><ul class="features-and-benefits-list-list"><li class="features-and-benefits-list-item">Resistance range includes E24 and E96 decade values from 1ohm to 10Mohm</li><li class="features-and-benefits-list-item">EIA 0603 case size</li><li class="features-and-benefits-list-item">Available in ?±100ppm/°C and -200ppm/°C to +400ppm/°C TCR values</li><li class="features-and-benefits-list-item">Available in ±1% and ±5% tolerance</li><li class="features-and-benefits-list-item">High reliability and stability</li><li class="features-and-benefits-list-item">Higher component and equipment reliability</li><li class="features-and-benefits-list-item">Lower assembly costs</li><li class="features-and-benefits-list-item">Reduced size of final equipment</li><li class="features-and-benefits-list-item">Continuous working voltage is 75V and rated power is 100; ComponentLink1URL: http://www.farnell.com/datasheets/1960319.pdf; ComponentLink1Description: http://www.farnell.com/datasheets/1960319.pdf; Supplier 1: Farnell; Supplier Part Number 1: 2502404; Supplier 2: Newark; Supplier Part Number 2: 58Y7264
R4 R9 R13 = CRCW060351R0FKEA: RES SMD 51 OHM 1% 1/10W 0603; Manufacturer: Vishay Dale; Power (Watts): 0.1W, 1/10W; Temperature Coefficient: ±100ppm/°C; Manufacturer Part Number: CRCW060351R0FKEA; RoHS: RoHS Compliant; Category: Resistors; Stock 1: 21691; Pricing 1: 1=0.1, 10=0.042, 100=0.017, 1000=0.00764, 2500=0.00663 (USD); Packaging: Cut Tape (CT); Part Status: Active; Tolerance: ±1%; Composition: Thick Film; Features: Automotive AEC-Q200; Operating Temperature: -55°C ~ 155°C; Package / Case: 0603 (1608 Metric); Supplier Device Package: 0603; Size / Dimension: 0.063" L x 0.033" W (1.60mm x 0.85mm); Height - Seated (Max): 0.020" (0.50mm); Failure Rate: -; ComponentLink1URL: http://www.vishay.com/docs/20035/dcrcwe3.pdf; ComponentLink1Description: http://www.vishay.com/docs/20035/dcrcwe3.pdf; Resistance: 51R; Supplier 1: Mouser; Supplier Part Number 1: 71-CRCW0603-51-E3; Supplier 2: Farnell; Supplier Part Number 2: 1652889; Supplier 3: Digi-Key; Supplier Part Number 3: 541-51.0HCT-ND
R6 = RC0603FR-072K4L: RES SMD 2.4K OHM 1% 1/10W 0603; Manufacturer: Yageo; Power (Watts): 0.1W, 1/10W; Temperature Coefficient: ±100ppm/°C; Manufacturer Part Number: RC0603FR-072K4L; RoHS: RoHS Compliant; Category: Resistors; Stock 1: 577810; Pricing 1: 1=0.1, 10=0.015, 100=0.006, 1000=0.00268, 2500=0.00233 (USD); Packaging: Cut Tape (CT); Part Status: Active; Tolerance: ±1%; Composition: Thick Film; Features: Moisture Resistant; Operating Temperature: -55°C ~ 155°C; Package / Case: 0603 (1608 Metric); Supplier Device Package: 0603; Size / Dimension: 0.063" L x 0.032" W (1.60mm x 0.80mm); Height - Seated (Max): 0.022" (0.55mm); Failure Rate: -; ComponentLink1URL: http://www.yageo.com/documents/recent/PYu-RC_Group_51_RoHS_L_8.pdf; ComponentLink1Description: http://www.yageo.com/documents/recent/PYu-RC_Group_51_RoHS_L_8.pdf; Resistance: 2k4; Supplier 1: Mouser; Supplier Part Number 1: 603-RC0603FR-072K4L; Supplier 2: Farnell; Supplier Part Number 2: 1799329; Supplier 3: Digi-Key; Supplier Part Number 3: 311-2.40KHRCT-ND
R8 = MCWR06X1101FTL: MULTICOMP - MCWR06X1101FTL - RES, THICK FILM, 1K1, 1%, 0.1W, 0603; Voltage Rating: 50; Resistor Case Style: 0603 [1608 Metric]; Power Rating: 100; Product Range: MCWR Series; Temperature Coefficient: ± 100; SVHC: No SVHC (07-Jul-2017)<!--FANDB--><div class="features-and-benefits-container"><div class="features-and-benefits-desc-container"><span class="features-and-benefits-container-desc">SMD Chip Resistor, Thick Film, 1.1 kohm, 50 V, 0603 [1608 Metric], 100 mW, ± 1; Supplier 1: Farnell; Supplier Part Number 1: 2447274; Manufacturer: MULTICOMP; Manufacturer Part Number: MCWR06X1101FTL; RoHS: Y-EX; Stock 1: 8493; Pricing 1: 10=0.0035, 100=0.0021, 500=0.0015, 1000=0.0012, 2500=0.001 (GBP); Resistance: 1k1; Resistance Tolerance: ± 1%; Packaging: Cut Tape; Resistor Element Material: Thick Film; Automotive Qualification Standard: -; ComponentLink1URL: http://www.farnell.com/datasheets/1849611.pdf; ComponentLink1Description: http://www.farnell.com/datasheets/1849611.pdf
R10 = CRCW06031M00FKEB: RES SMD 1M OHM 1% 1/10W 0603; Manufacturer: Vishay Dale; Power (Watts): 0.1W, 1/10W; Temperature Coefficient: ±100ppm/°C; Manufacturer Part Number: CRCW06031M00FKEB; RoHS: RoHS Compliant; Category: Resistors; Stock 1: 0; Pricing 1: 20000=0.00432, 30000=0.00405 (USD); Packaging: Tape & Reel (TR); Part Status: Active; Tolerance: ±1%; Composition: Thick Film; Features: Automotive AEC-Q200; Operating Temperature: -55°C ~ 155°C; Package / Case: 0603 (1608 Metric); Supplier Device Package: 0603; Size / Dimension: 0.063" L x 0.033" W (1.60mm x 0.85mm); Height - Seated (Max): 0.020" (0.50mm); Failure Rate: -; ComponentLink1URL: http://www.vishay.com/docs/20035/dcrcwe3.pdf; ComponentLink1Description: http://www.vishay.com/docs/20035/dcrcwe3.pdf; Resistance: 1M; Supplier 1: Mouser; Supplier Part Number 1: 71-CRCW06031M00FKEB; Supplier 2: Farnell; Supplier Part Number 2: 1853280; Supplier 3: Digi-Key; Supplier Part Number 3: CRCW06031M00FKEB-ND
U1 = SN74LVC86APWR: 4-ch, 2-input, 1.65-V to 3.6-V XOR (exclusive OR) gates 14-TSSOP -40 to 125; Manufacturer: Texas Instruments; Number of Elements: 4; Propagation Delay: 4.4ns; Max Supply Voltage: 3.6V; Min Supply Voltage: 1.65V; Number of Outputs: 1; Number of Inputs: 2; Quiescent Current: 1uA; High Level Output Current: -24mA; Low Level Output Current: 24mA; Turn-On Delay Time: 4.6ns; Schmitt Trigger Input: No; Supplier 1: Mouser; Supplier Part Number 1: 595-SN74LVC86APWR; Manufacturer Part Number: SN74LVC86APWR; RoHS: Yes; Category: Logic Gates; Stock 1: 443; Pricing 1: 1=0.49000, 10=0.39400, 50=0.39400, 100=0.24300, 1000=0.15100, 10000=0.13800 (USD); Mount: Surface Mount; Case/Package: TSSOP; Number of Pins: 14; Weight: 0.002018oz; Contact Plating: Gold; Min Operating Temperature: -40°C; Max Operating Temperature: 125°C; Packaging: Tape and Reel; Logic Function: XOR; Package Quantity: 1; Number of Circuits: 4; Number of Gates: 4; Number of Input Lines: 2; Number of Output Lines: 1; Number of Bits: 4; Length: 5mm; Width: 4.4mm; Height: 1.15mm; Radiation Hardening: No; Lead Free: Lead Free; RoHS Compliant: Yes; REACH SVHC: No SVHC; ComponentLink1URL: https://datasheet.ciiva.com/14290/sn54lvc86a-14290721.pdf?src-supplier=Avnet; ComponentLink1Description: https://datasheet.ciiva.com/14290/sn54lvc86a-14290721.pdf?src-supplier=Avnet; ComponentLink2URL: https://datasheet.ciiva.com/41455/001017231-da-01-en-ic-qu-2in-exc-sn74lvc86apwr-tssop-14-tid-41455867.pdf?src-supplier=Conrad; ComponentLink2Description: https://datasheet.ciiva.com/41455/001017231-da-01-en-ic-qu-2in-exc-sn74lvc86apwr-tssop-14-tid-41455867.pdf?src-supplier=Conrad; ComponentLink3URL: https://datasheet.ciiva.com/46439/1847506-46439206.pdf?src-supplier=Element14; ComponentLink3Description: https://datasheet.ciiva.com/46439/1847506-46439206.pdf?src-supplier=Element14; ComponentLink4URL: https://datasheet.ciiva.com/1865/sn74lvc86a-1865017.pdf?src-supplier=Digi-Key; ComponentLink4Description: https://datasheet.ciiva.com/1865/sn74lvc86a-1865017.pdf?src-supplier=Digi-Key; ComponentLink5URL: https://datasheet.ciiva.com/1865/sn74lvc86a-1865016.pdf?src-supplier=Digi-Key; ComponentLink5Description: https://datasheet.ciiva.com/1865/sn74lvc86a-1865016.pdf?src-supplier=Digi-Key; ComponentLink6URL: https://datasheet.ciiva.com/1865/sn74lvc86a-1865018.pdf?src-supplier=Digi-Key; ComponentLink6Description: https://datasheet.ciiva.com/1865/sn74lvc86a-1865018.pdf?src-supplier=Digi-Key; ComponentLink7URL: https://datasheet.ciiva.com/15221/getdatasheetpartid-247160-15221930.pdf?src-supplier=Verical; ComponentLink7Description: https://datasheet.ciiva.com/15221/getdatasheetpartid-247160-15221930.pdf?src-supplier=Verical; Supplier 2: Farnell; Supplier Part Number 2: 3120672; Supplier 3: Digi-Key; Supplier Part Number 3: 296-1242-1-ND; Supplier 4: Arrow Electronics; Supplier Part Number 4: SN74LVC86APWR
U2 = NE5532DR: 2-channel, 10-MHz, 26-V output swing, low-noise audio op amp 8-SOIC 0 to 70; Manufacturer: Texas Instruments; Bandwidth: 10MHz; Number of Channels: 2; Voltage Gain: 100dB; Min Dual Supply Voltage: 5V; Max Dual Supply Voltage: 15V; Output Current: 38mA; Nominal Supply Current: 16mA; Common Mode Rejection Ratio: 70dB; Slew Rate: 9V/µs; Max I/O Voltage: 4mV; Input Bias Current: 800nA; Operating Supply Current: 8mA; Dual Supply Voltage: 9V; Parameter 1: Jellybean; Supplier 1: Mouser; Supplier Part Number 1: 595-NE5532DR; Manufacturer Part Number: NE5532DR; RoHS: Yes; Category: Amplifiers - Op Amps, Buffer, Instrumentation; Pricing 1: 1=0.60000, 10=0.51400, 50=0.51400, 100=0.35600, 500=0.30100, 1000=0.23300, 2500=0.21100, 10000=0.21100 (USD); Case/Package: D; Number of Pins: 8; Contact Plating: Gold; Min Operating Temperature: 0°C; Max Operating Temperature: 70°C; Packaging: Tape and Reel; Number of Circuits: 2; Gain Bandwidth Product: 10MHz; Unity Gain Bandwidth Product: 10MHz; Package Quantity: 1; Nominal Gain Bandwidth Product: 10MHz; Input Offset Voltage (Vos): 4mV; Output Current per Channel: 38mA; Number of Elements: 2; Max Supply Voltage: 15V; Number of Amplifiers: 2; Length: 4.9mm; Width: 3.91mm; Height: 1.58mm; Radiation Hardening: No; Lead Free: Lead Free; RoHS Compliant: Yes; REACH SVHC: No SVHC; ComponentLink1URL: https://datasheet.ciiva.com/1796/ne5532-1796190.pdf?src-supplier=Digi-Key; ComponentLink1Description: https://datasheet.ciiva.com/1796/ne5532-1796190.pdf?src-supplier=Digi-Key; ComponentLink2URL: https://datasheet.ciiva.com/1796/ne5532-1796189.pdf?src-supplier=Digi-Key; ComponentLink2Description: https://datasheet.ciiva.com/1796/ne5532-1796189.pdf?src-supplier=Digi-Key; ComponentLink3URL: https://datasheet.ciiva.com/1796/ne5532-1796191.pdf?src-supplier=Digi-Key; ComponentLink3Description: https://datasheet.ciiva.com/1796/ne5532-1796191.pdf?src-supplier=Digi-Key; Supplier 2: Farnell; Supplier Part Number 2: 3117312; Supplier 3: Digi-Key; Supplier Part Number 3: 296-13622-6-ND
U3 = LDK320M33R: IC REG LINEAR 200MA SOT23-5; Manufacturer: STMicroelectronics; Output Configuration: Positive; Output Type: Fixed; Voltage - Input (Max): 18V; Voltage - Output (Min/Fixed): 3.3V; Voltage Dropout (Max): 0.35V @ 200mA; PSRR: 88dB (120Hz); Control Features: Enable; Protection Features: Over Current, Over Temperature; Manufacturer Part Number: LDK320M33R; RoHS: RoHS Compliant; Category: Integrated Circuits (ICs); Stock 1: 5592; Pricing 1: 1=0.85, 10=0.748, 100=0.5733, 500=0.4532, 1000=0.36256 (USD); Packaging: Cut Tape (CT); Part Status: Active; Current - Output: 200mA; Operating Temperature: -40°C ~ 125°C (TJ); Mounting Type: Surface Mount; Package / Case: SC-74A, SOT-753; Supplier Device Package: SOT-23-5; ComponentLink1URL: http://www.st.com/content/ccc/resource/technical/document/datasheet/0e/0c/26/c9/a4/d4/4b/a1/DM00236470.pdf/files/DM00236470.pdf/jcr:content/translations/en.DM00236470.pdf; ComponentLink1Description: http://www.st.com/content/ccc/resource/technical/document/datasheet/0e/0c/26/c9/a4/d4/4b/a1/DM00236470.pdf/files/DM00236470.pdf/jcr:content/translations/en.DM00236470.pdf; Supplier 1: Mouser; Supplier Part Number 1: 511-LDK320M33R; Supplier 2: Farnell; Supplier Part Number 2: 3130011; Supplier 3: Digi-Key; Supplier Part Number 3: 497-17034-1-ND